# EAGLE design ARM_critter_v02 (EAGLE 6.1)
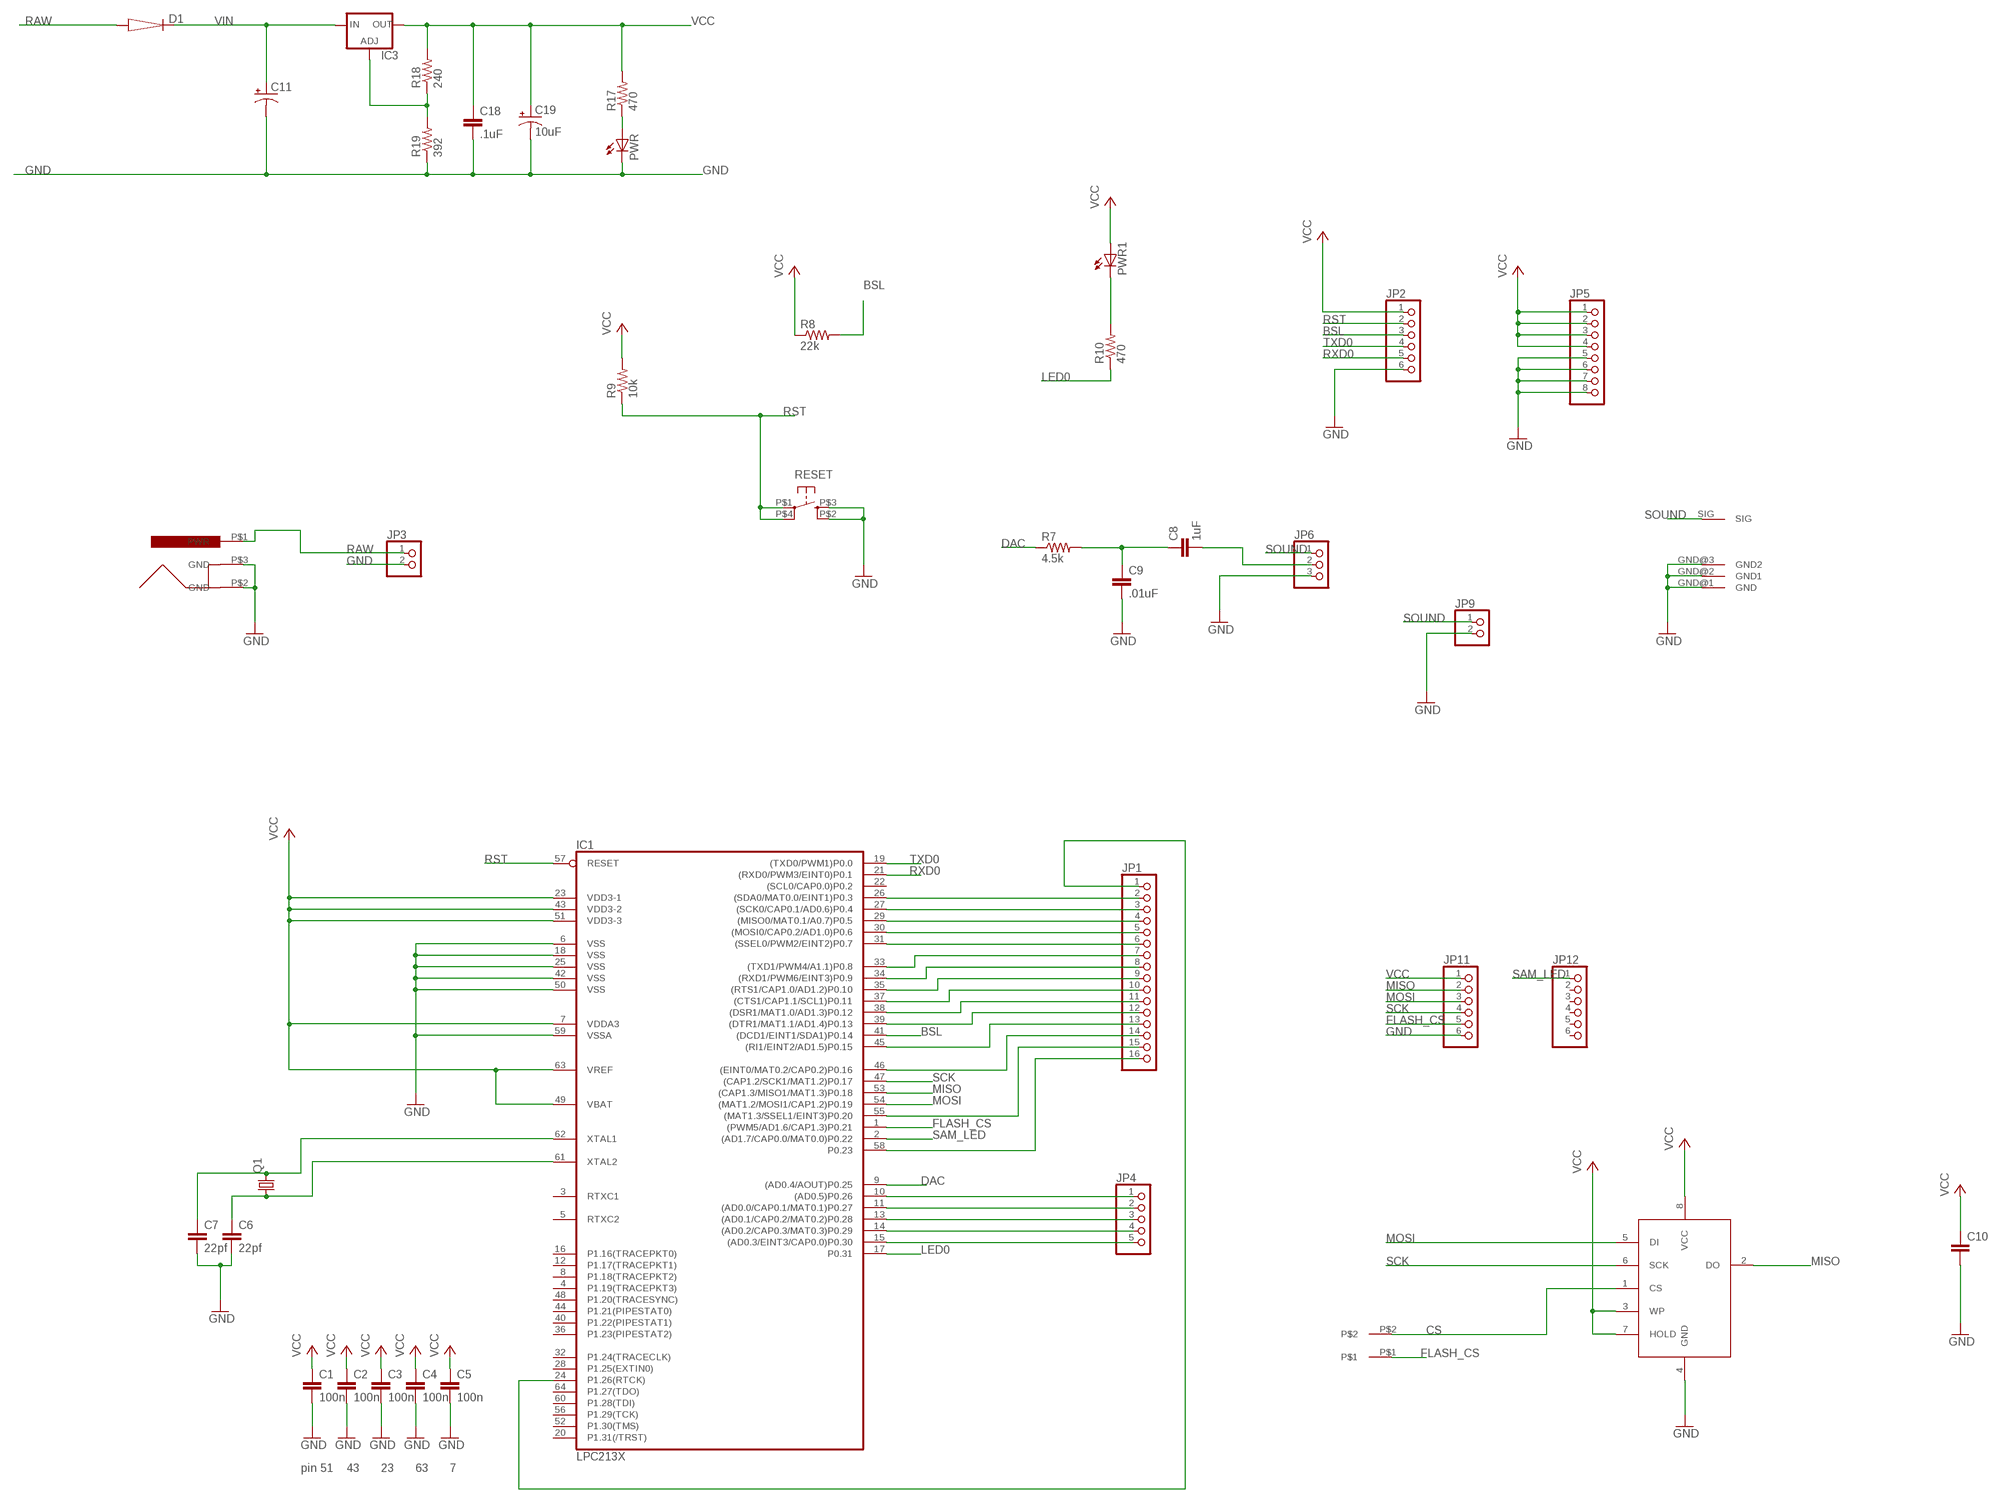
[diagram p0: schematic, sheet 1]

## Parts
C1  100n  CAP0603  [C0603]
C2  100n  CAP0603  [C0603]
C3  100n  CAP0603  [C0603]
C4  100n  CAP0603  [C0603]
C5  100n  CAP0603  [C0603]
C6  22pf  CAP0603  [C0603]
C7  22pf  CAP0603  [C0603]
C8  1uF  CAP0603  [C0603]
C9  .01uF  CAP0603  [C0603]
C10  CAP0603  [C0603]
C11  CPOL-USE3.5-8  [E3,5-8]
C18  .1uF  CAP0603  [C0603]
C19  10uF  CAP_POL1206  [CPOL_1206]
D1  DIODESMB  [SMB]
IC1  LPC213X  [SQFP-S-10X10-64]
IC3  V_REG_FAN1117SOT223  [SOT223]
JP1  PINHD-1X16  [1X16]
JP2  PINHD-1X6  [1X06]
JP3  PINHD-1X2  [1X02]
JP4  PINHD-1X5  [1X05]
JP5  PINHD-1X8  [1X08]
JP6  PINHD-1X3  [1X03]
JP9  PINHD-1X2  [1X02]
JP11  PINHD-1X6  [1X06]
JP12  PINHD-1X6  [1X06]
PWR  LED1206  [CHIPLED_1206]
PWR1  LED1206  [CHIPLED_1206]
Q1  CRYSTALHC49UV  [HC49U-V]
R7  4.5k  RES0603  [R0603]
R8  22k  RES0603  [R0603]
R9  10k  RES0603  [R0603]
R10  470  RES0603  [R0603]
R17  470  RES0603  [R0603]
R18  240  RES0603  [R0603]
R19  392  RES0603  [R0603]
RESET  RESET_SWITCH  [TACTILE_SWITCH_SMD]
U$1  POWER_JACK  POWER_JACKTHRU-HOLE  [POWER_JACK]
U$2  M25PXX  [SO08]
U$3  JUMPER_SOL  [JUMPER_SOL]
U$5  PHONO_PLUG  [PHONO_PCB]

## Nets
BSL: IC1.41((DCD1/EINT1/SDA1)P0.14) JP2.3 R8.2
CS: U$2.1(CS) U$3.P$2
DAC: IC1.9((AD0.4/AOUT)P0.25) R7.1
FLASH_CS: IC1.1((PWM5/AD1.6/CAP1.3)P0.21) JP11.5 U$3.P$1
GND [power]: C1.2 C2.2 C3.2 C4.2 C5.2 C6.2 C7.2 C9.2 C10.2 C11.- C18.2 C19.C(-) IC1.6(VSS) IC1.18(VSS) IC1.25(VSS) IC1.42(VSS) IC1.50(VSS) IC1.59(VSSA) JP2.6 JP3.2 JP5.5 JP5.6 JP5.7 JP5.8 JP6.3 JP9.2 JP11.6 PWR.C R19.1 RESET.P$2(S1) RESET.P$3(S) U$1.P$2(GND) U$1.P$3(GND) U$2.4(GND) U$5.GND@1(GND) U$5.GND@2(GND1) U$5.GND@3(GND2)
LED0: IC1.17(P0.31) R10.1
MISO: IC1.53((CAP1.3/MISO1/MAT1.3)P0.18) JP11.2 U$2.2(DO)
MOSI: IC1.54((MAT1.2/MOSI1/CAP1.2)P0.19) JP11.3 U$2.5(DI)
N$1: C8.1 C9.1 R7.2
N$2: C7.1 IC1.62(XTAL1) Q1.2
N$3: C6.1 IC1.61(XTAL2) Q1.1
N$4: PWR1.C R10.2
N$5: IC1.24(P1.26(RTCK)) JP1.1
N$7: C8.2 JP6.2
N$9: IC1.26((SDA0/MAT0.0/EINT1)P0.3) JP1.2
N$10: IC1.27((SCK0/CAP0.1/AD0.6)P0.4) JP1.3
N$11: IC3.1(ADJ) R18.1 R19.2
N$12: IC1.29((MISO0/MAT0.1/A0.7)P0.5) JP1.4
N$13: IC1.30((MOSI0/CAP0.2/AD1.0)P0.6) JP1.5
N$14: IC1.31((SSEL0/PWM2/EINT2)P0.7) JP1.6
N$15: IC1.33((TXD1/PWM4/A1.1)P0.8) JP1.7
N$16: IC1.34((RXD1/PWM6/EINT3)P0.9) JP1.8
N$17: IC1.35((RTS1/CAP1.0/AD1.2)P0.10) JP1.9
N$18: IC1.37((CTS1/CAP1.1/SCL1)P0.11) JP1.10
N$19: IC1.38((DSR1/MAT1.0/AD1.3)P0.12) JP1.11
N$20: IC1.39((DTR1/MAT1.1/AD1.4)P0.13) JP1.12
N$21: IC1.45((RI1/EINT2/AD1.5)P0.15) JP1.13
N$22: IC1.46((EINT0/MAT0.2/CAP0.2)P0.16) JP1.14
N$23: IC1.55((MAT1.3/SSEL1/EINT3)P0.20) JP1.15
N$24: PWR.A R17.1
N$25: IC1.58(P0.23) JP1.16
N$26: IC1.10((AD0.5)P0.26) JP4.1
N$27: IC1.11((AD0.0/CAP0.1/MAT0.1)P0.27) JP4.2
N$28: IC1.13((AD0.1/CAP0.2/MAT0.2)P0.28) JP4.3
N$29: IC1.14((AD0.2/CAP0.3/MAT0.3)P0.29) JP4.4
N$30: IC1.15((AD0.3/EINT3/CAP0.0)P0.30) JP4.5
RAW: D1.2(C) JP3.1 U$1.P$1(PWR)
RST: IC1.57(RESET) JP2.2 R9.1 RESET.P$1(P) RESET.P$4(P1)
RXD0: IC1.21((RXD0/PWM3/EINT0)P0.1) JP2.5
SAM_LED: IC1.2((AD1.7/CAP0.0/MAT0.0)P0.22) JP12.1
SCK: IC1.47((CAP1.2/SCK1/MAT1.2)P0.17) JP11.4 U$2.6(SCK)
SOUND: JP6.1 JP9.1 U$5.SIG
TXD0: IC1.19((TXD0/PWM1)P0.0) JP2.4
VCC [power]: C1.1 C2.1 C3.1 C4.1 C5.1 C10.1 C18.1 C19.A(+) IC1.7(VDDA3) IC1.23(VDD3-1) IC1.43(VDD3-2) IC1.49(VBAT) IC1.51(VDD3-3) IC1.63(VREF) IC3.2(OUT) JP2.1 JP5.1 JP5.2 JP5.3 JP5.4 JP11.1 PWR1.A R8.1 R9.2 R17.2 R18.2 U$2.3(WP) U$2.7(HOLD) U$2.8(VCC)
VIN [power]: C11.+ D1.1(A) IC3.3(IN)
Unconnected: IC1.3(RTXC1) IC1.4(P1.19(TRACEPKT3)) IC1.5(RTXC2) IC1.8(P1.18(TRACEPKT2)) IC1.12(P1.17(TRACEPKT1)) IC1.16(P1.16(TRACEPKT0)) IC1.20(P1.31(/TRST)) IC1.22((SCL0/CAP0.0)P0.2) IC1.28(P1.25(EXTIN0)) IC1.32(P1.24(TRACECLK)) IC1.36(P1.23(PIPESTAT2)) IC1.40(P1.22(PIPESTAT1)) IC1.44(P1.21(PIPESTAT0)) IC1.48(P1.20(TRACESYNC)) IC1.52(P1.30(TMS)) IC1.56(P1.29(TCK)) IC1.60(P1.28(TDI)) IC1.64(P1.27(TDO)) JP12.2 JP12.3 JP12.4 JP12.5 JP12.6

## Notes on the sheet
- pin 51 | 43 | 23 | 63 | 7

## Library data of the parts
C1-C10 C18 = SparkFun:CAP: CAPACITOR
C11 = rcl:CPOL-US: POLARIZED CAPACITOR, American symbol
C19 = SparkFun:CAP_POL
D1 = SparkFun:DIODE
IC1 = SparkFun:LPC213X
IC3 = SparkFun:V_REG_FAN1117: VOLTAGE REGULATOR
JP1 = pinhead:PINHD-1X16: PIN HEADER
JP2 JP11 JP12 = pinhead:PINHD-1X6: PIN HEADER
JP3 JP9 = pinhead:PINHD-1X2: PIN HEADER
JP4 = pinhead:PINHD-1X5: PIN HEADER
JP5 = pinhead:PINHD-1X8: PIN HEADER
JP6 = pinhead:PINHD-1X3: PIN HEADER
PWR PWR1 = SparkFun:LED
Q1 = SparkFun:CRYSTAL
R7-R10 R17-R19 = SparkFun:RES: RESISTOR
RESET = SparkFun:RESET_SWITCH: OMRON SWITCH
U$1 = SparkFun:POWER_JACK
U$2 = sfe_owen:M25PXX
U$3 = SparkFun:JUMPER_SOL
U$5 = sfe_owen:PHONO_PLUG

## Net classes
0 default: width 0.254 mm
1 power: width 0.254 mm

## Board
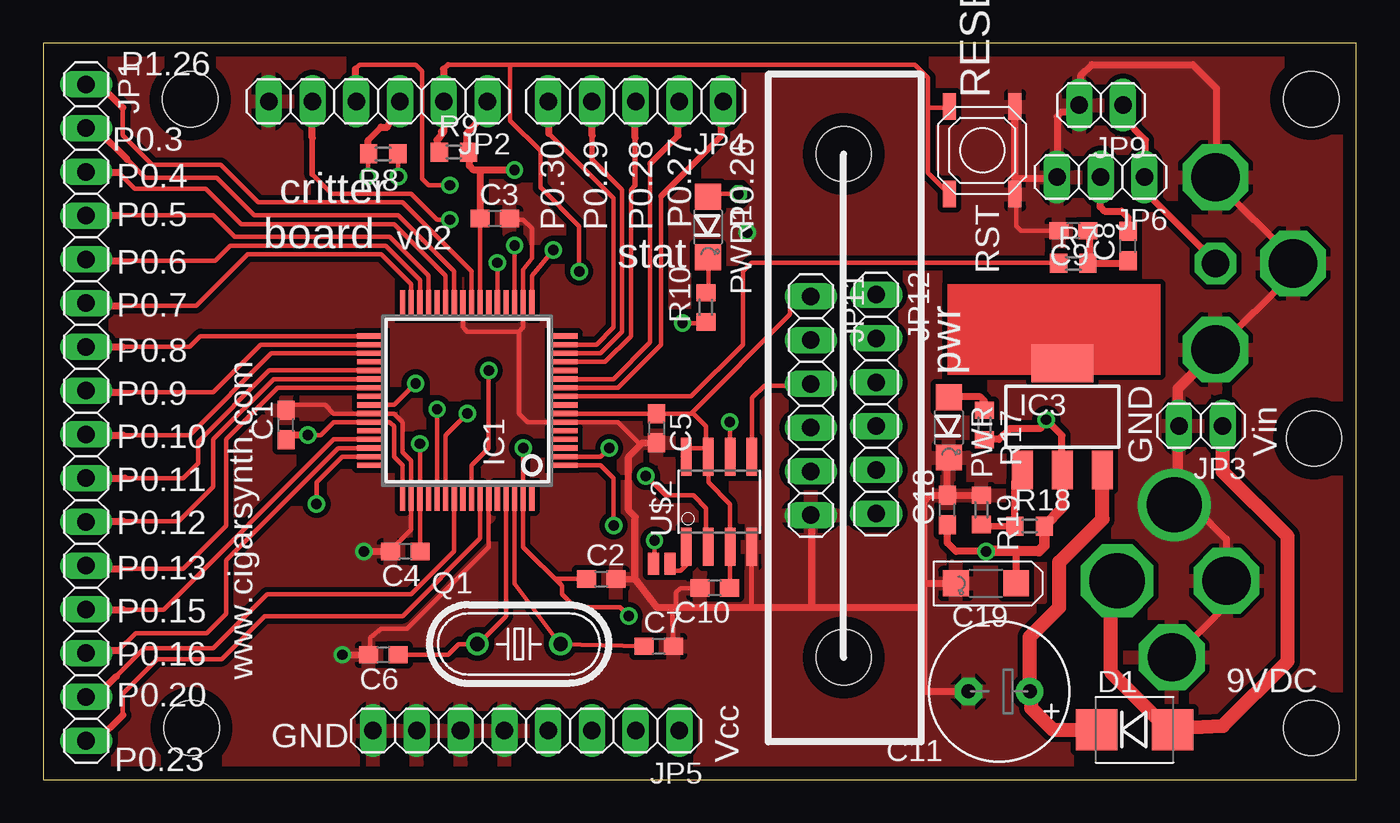
[diagram p1: board, top side]
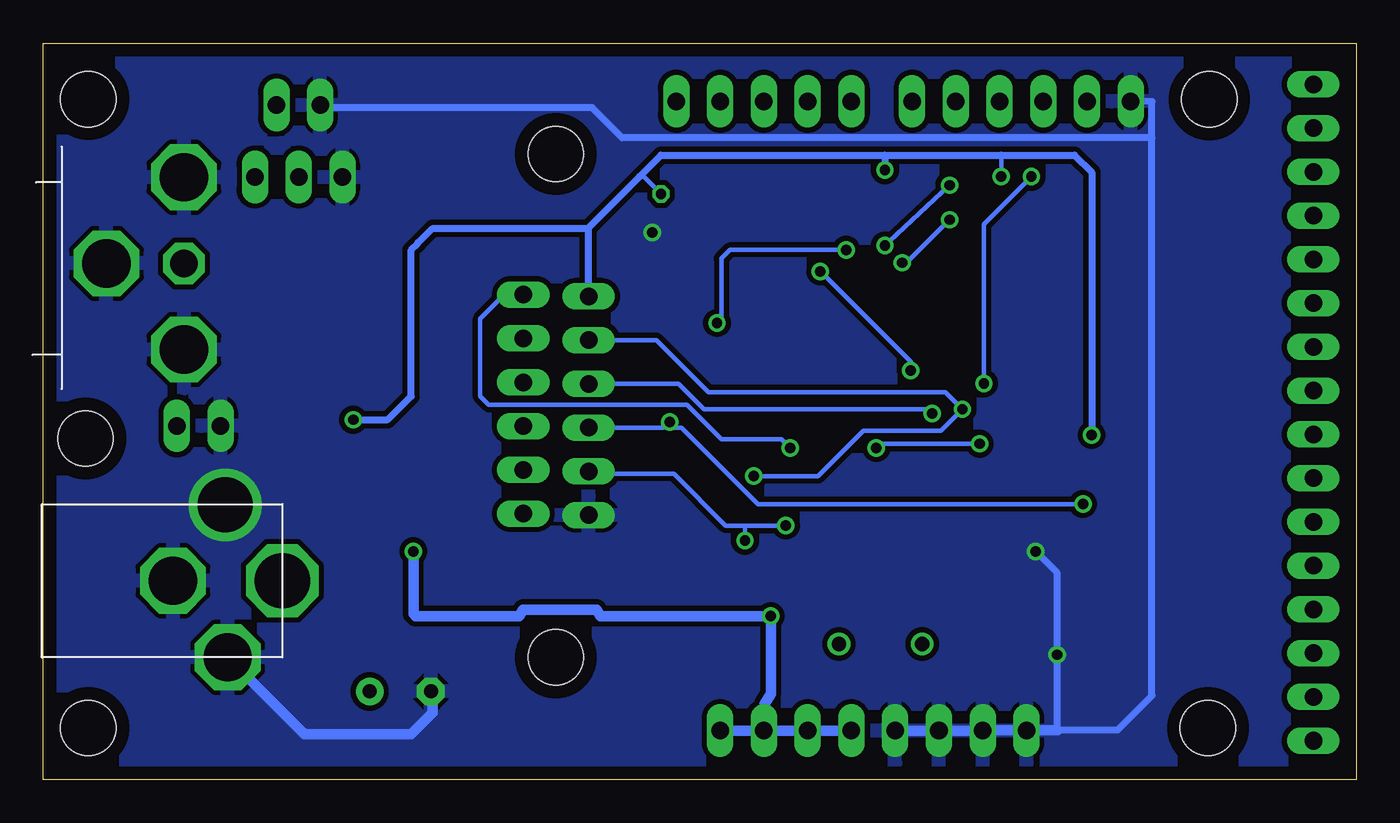
[diagram p2: board, bottom side, seen from below]

Size 76.25 x 42.75 mm. Coordinates in mm from the lower left corner, seen from the top.
Outline: 0,0 76.25,0 76.25,42.75 0,42.75 0,0
Copper layers (1*16): Top 0.035mm / dielectric 1.5mm / Bottom 0.035mm
Design rules: minimum track width 10mil, minimum drill 20mil, track to track 0.2mm, track to pad 0.2mm, pad to pad 0.2mm, via to via 0.2mm, smd to smd 0.2mm, copper to edge 30mil, drill to drill 8mil, minimum pad ring 10mil, minimum via ring 8mil, stop-mask expansion 4mil, vias tented up to drill 0mil, thermal gap 10mil
Holes 3.2 mm at 46.48,7.1 46.48,36.31 73.62,3 73.62,39.5 73.78,19.8 8.54,39.48 8.62,3

### Footprints (pad centres in the part's own frame; a part is rotated, then mirrored left to right if it is on the bottom)
C0603 = smd 1.1 x 1: 1 -0.85,0; 2 0.85,0
E3,5-8 = drill 0.813 pad 1.6: + -1.778,0 | drill 0.813 pad 1.6 octagon: - 1.778,0
CPOL_1206 = smd 1.5 x 1.5: A 0,-1.75; C 0,1.75
SMB = smd 2.4 x 2.4: 1 -2.2,0; 2 2.2,0
SQFP-S-10X10-64 = smd 0.3 x 1.6: 1 -3.75,-5.6; 2 -3.25,-5.6; 3 -2.75,-5.6; 4 -2.25,-5.6; 5 -1.75,-5.6; 6 -1.25,-5.6; 7 -0.75,-5.6; 8 -0.25,-5.6; 9 0.25,-5.6; 10 0.75,-5.6; 11 1.25,-5.6; 12 1.75,-5.6; 13 2.25,-5.6; 14 2.75,-5.6; 15 3.25,-5.6; 16 3.75,-5.6; 33 3.75,5.6; 34 3.25,5.6; 35 2.75,5.6; 36 2.25,5.6; 37 1.75,5.6; 38 1.25,5.6; 39 0.75,5.6; 40 0.25,5.6; 41 -0.25,5.6; 42 -0.75,5.6; 43 -1.25,5.6; 44 -1.75,5.6; 45 -2.25,5.6; 46 -2.75,5.6; 47 -3.25,5.6; 48 -3.75,5.6 | smd 1.6 x 0.3: 17 5.6,-3.75; 18 5.6,-3.25; 19 5.6,-2.75; 20 5.6,-2.25; 21 5.6,-1.75; 22 5.6,-1.25; 23 5.6,-0.75; 24 5.6,-0.25; 25 5.6,0.25; 26 5.6,0.75; 27 5.6,1.25; 28 5.6,1.75; 29 5.6,2.25; 30 5.6,2.75; 31 5.6,3.25; 32 5.6,3.75; 49 -5.6,3.75; 50 -5.6,3.25; 51 -5.6,2.75; 52 -5.6,2.25; 53 -5.6,1.75; 54 -5.6,1.25; 55 -5.6,0.75; 56 -5.6,0.25; 57 -5.6,-0.25; 58 -5.6,-0.75; 59 -5.6,-1.25; 60 -5.6,-1.75; 61 -5.6,-2.25; 62 -5.6,-2.75; 63 -5.6,-3.25; 64 -5.6,-3.75
SOT223 = smd 1.219 x 2.235: 1 -2.311,-3.099; 2 0,-3.099; 3 2.311,-3.099 | smd 3.6 x 2.2: 4 0,3.099
1X16 = drill 1.016 long: 1 -19.05,0; 2 -16.51,0; 3 -13.97,0; 4 -11.43,0; 5 -8.89,0; 6 -6.35,0; 7 -3.81,0; 8 -1.27,0; 9 1.27,0; 10 3.81,0; 11 6.35,0; 12 8.89,0; 13 11.43,0; 14 13.97,0; 15 16.51,0; 16 19.05,0
1X06 = drill 1.016 long: 1 -6.35,0; 2 -3.81,0; 3 -1.27,0; 4 1.27,0; 5 3.81,0; 6 6.35,0
1X02 = drill 1.016 long: 1 -1.27,0; 2 1.27,0
1X05 = drill 1.016 long: 1 -5.08,0; 2 -2.54,0; 3 0,0; 4 2.54,0; 5 5.08,0
1X08 = drill 1.016 long: 1 -8.89,0; 2 -6.35,0; 3 -3.81,0; 4 -1.27,0; 5 1.27,0; 6 3.81,0; 7 6.35,0; 8 8.89,0
1X03 = drill 1.016 long: 1 -2.54,0; 2 0,0; 3 2.54,0
CHIPLED_1206 = smd 1.5 x 1.5: A 0,-1.75; C 0,1.75
HC49U-V = drill 0.813: 1 -2.413,0; 2 2.413,0
R0603 = smd 1 x 1.1: 1 -0.85,0; 2 0.85,0
TACTILE_SWITCH_SMD = smd 1.524 x 0.762: P$1 -2.54,1.905; P$2 -2.54,-1.905; P$3 2.54,-1.905; P$4 2.54,1.905
POWER_JACK = drill 3.2 octagon: P$1 0,4.445 | drill 2.8 octagon: P$2 3.175,8.89; P$3 6.35,4.445
SO08 = smd 0.61 x 2.21: 1 -1.905,-2.616; 2 -0.635,-2.616; 3 0.635,-2.616; 4 1.905,-2.616; 5 1.905,2.616; 6 0.635,2.616; 7 -0.635,2.616; 8 -1.905,2.616
JUMPER_SOL = smd 0.635 x 1.27: P$1 0,0; P$2 0.953,0
PHONO_PCB = drill 2.8 octagon: GND@1 0,5; GND@2 0,-5; GND@3 4.5,0 | drill 1.6 octagon: SIG 0,0

### Placement (x,y rotation side)
C1  14.11,20.58 90 top
C2  32.41,11.65 0 top
C3  26.23,32.57 0 top
C4  21.03,13.25 180 top
C5  35.61,20.39 270 top
C6  19.75,7.25 180 top
C7  35.75,7.75 0 top
C8  62.99,30.97 90 top
C9  59.81,31.86 180 top
C10  39,11.12 180 top
C11  55.51,5.12 180 top
C18  52.5,15.65 90 top
C19  54.74,11.39 90 top
D1  63.37,2.9 0 top
IC1  24.62,22 90 top
IC3  59.18,21.07 0 top
JP1  2.5,21.31 270 top
JP2  19.45,39.37 180 top
JP3  67.22,20.54 180 top
JP4  34.41,39.37 180 top
JP5  28.05,2.85 180 top
JP6  61.4,34.98 180 top
JP9  61.42,39.15 180 top
JP11  44.58,21.7 270 top
JP12  48.37,21.8 270 top
PWR  52.59,20.45 180 top
PWR1  38.61,32.08 180 top
Q1  27.62,7.88 0 top
R7  59.81,29.96 0 top
R8  19.75,36.32 180 top
R9  23.85,36.42 0 top
R10  38.48,27.41 90 top
R17  54.65,20.59 270 top
R18  57.27,14.72 0 top
R19  54.48,15.66 270 top
RESET  54.52,36.52 90 top
U$1  62.35,15.99 180 bottom
U$2  39.25,16.12 0 top
U$3  35.44,12.53 0 top
U$5  68.07,29.96 180 bottom

### Tracks (layer width: path | path; a pad name or v marks a point on that pad's centre or on a via)
BSL  (via drill 0.6)
  Top 0.254: v18.88,35 18.88,36.17 R8.2 18.88,36.47 | 18.88,21.75 IC1.41 20.38,21.75 v21.62,23
  Top 0.305: 18.88,37.12 19.62,37.88
  Top 0.406: JP2.3 20,37.88 19.62,37.88 | 18.88,36.47 18.88,37.12
  Bottom 0.254: v18.88,35 21.62,32.25 v21.62,23
CS
  Top 0.254: U$2.1 37.34,12.47 37,12.12 36.38,12.12 36.39,12.14 U$3.P$2
DAC
  Top 0.254: IC1.9 37.62,22.25 40.62,25.25 40.62,29.5 41.12,30 58.62,30 58.88,29.75 58.97,29.84 R7.1
FLASH_CS  (via drill 0.6)
  Top 0.254: IC1.1 32.38,18.25 33.12,17.5 v33.12,14.75 | U$3.P$1 35.46,12.12 35.5,12.12 v35.5,13.88
  Bottom 0.254: JP11.5 44.47,18 44.22,17.75 39.62,17.75 36.62,14.75 35.5,14.75 | 35.5,14.75 v33.12,14.75 | v35.5,13.88 35.5,14.75
GND  (via drill 0.6, 3.2)
  Top 0.254: C1.2 14.12,21.44 14.12,21.75 16.38,21.75 16.88,21.25 IC1.42 20.38,21.25 20.88,20.75 20.88,19 21.38,18.5 21.38,16.25 | 21.38,16.25 21.38,14.5 20.12,13.25 C4.2 | C5.2 35.61,19.51 35.62,19.5 34.62,19.5 33.38,20.75 IC1.6 28.12,20.75 27.62,21.25 27.62,26 | IC1.25 24.38,26.25 24.62,26 27.62,26 | 27.62,26 27.88,26.25 IC1.18 27.88,29.6 28.38,30.25 28.38,32 27.88,32.5 27.12,32.5 27.12,32.53 C3.2 | 21.38,16.25 IC1.50 | IC1.59 25.88,13.5 21.12,8.75 19.62,8.75 19,8.25 19,7.25 | U$2.4 41.12,12.5 41.12,10 | C10.2 37,11.12 36.75,10.88 36.75,10 | 36.5,10 C7.2 | 60.12,38.88 60.02,38.9 | C9.2 56.76,31.86 56.5,32.12 56.5,33.88 56.39,33.98
  Top 0.406: 68.07,24.88 67.91,24.72 | 68.07,24.88 U$5.GND@1 | 68.07,24.88 72.57,29.38 U$5.GND@3 72.57,30.22 68.07,34.72 U$5.GND@2 68.12,34.91 | 44.62,10 41.12,10 36.75,10 36.5,10 35.62,10 34.38,11.62 | 44.62,10 51.12,10 51.13,11.38 | JP11.6 44.62,15.12 44.62,10 | C2.2 34.38,11.62 | RESET.P$3 56.49,39 56.5,39 | 56.5,34.38 56.38,33.88 56.38,33.93 RESET.P$2 56.39,33.98 56.38,34 56.43,34.05 RESET.P$3 | v18.62,13.25 20.12,13.25 | v17.38,7.25 19,7.25 C6.2 | 51.13,11.38 51.13,11.51 | 51.13,11.51 51.13,5.83 | 51.13,5.83 51.09,5.21 51.12,5.12 | 51.13,11.38 51.13,11.49 51.13,11.51 | 51.13,11.51 51.13,16.14 51.5,16.5 C18.2 | C5.2 34.79,19.54 34,18.75 34,15.62 34.38,15.25 34.38,11.62 | v65.68,15.95 65.68,15.82 65.88,15.62 67,15.62 68.67,13.96 68.7,13.96 U$1.P$3 68.7,10.12 65.69,7.1 U$1.P$2 65.5,7.07 | C9.2 58.88,31.86 58.88,31.88 59.02,32.02 | R19.1 C18.2 | PWR.C 52.5,18.7 C18.2 | C18.2 | 51.13,11.38 51.12,11.38 51.14,11.39 C19.C | 51.12,5.12 53.75,5.12 | 51.13,5.83 51.12,5.82 51.12,5.25 | 51.12,5.25 51.12,6 51.12,5.12 | 51.12,5.25 51.12,5.12 | 60.02,38.9 60.25,38.9 60.25,40.88 60.88,41.5 66.75,41.5 68.12,40.12 68.12,34.91 | 68.12,34.91 68.12,34.88 | JP9.2 60.15,38.85 60.12,38.88 60,38.75 59.12,38.75 58.88,38.5 58.88,34.99 JP6.3 58.86,34.88 | 58.86,34.88 58.88,34.88 | RESET.P$3 56.43,34.88 58.86,34.88
  Top 0.61: 67.91,24.72 65.88,22.68 65.88,20.5 65.91,20.5 JP3.2 65.88,20.09 65.88,15.77 | 65.88,15.77 65.62,15.88 | 65.88,15.77 v65.68,15.95
  Bottom 0.406: 11.88,37.25 42.62,37.25 44.38,39 59.88,39 60.12,38.75 JP9.2 | 11.88,37.25 11.88,4.88 13.88,2.88 17.38,2.88 v17.38,7.25 17.38,12 v18.62,13.25 | JP2.6 11.88,39.34 11.88,37.25
  Bottom 0.61: 21.73,2.85 21.62,2.88 17.38,2.88 | 21.73,2.85 JP5.7 | 21.73,2.85 24.15,2.85 24.38,2.75 24.35,2.85 JP5.6 26.73,2.85 | 26.73,2.85 26.65,2.85 26.88,2.88 26.73,2.85 | 26.73,2.85 JP5.5 | 65.5,7.07 61.05,2.62 54.88,2.62 53.62,3.88 53.62,5.12 53.61,5.25 C11.-
  other vias: 40.88,31.75
  pour Top (isolate 0.305): -0.75,43.25 77.62,43.25 77.62,-0.62 -0.75,-0.62
  pour Bottom (isolate 0.305): -1.88,43.5 78.38,43.5 78.38,-1.38 -2.12,-1.38
LED0  (via drill 0.6)
  Top 0.254: R10.1 38.42,26.5 v37.12,26.5 | v29.62,30.75 28.38,29.25 IC1.17
  Bottom 0.254: v37.12,26.5 36.88,26.75 36.88,30.25 36.38,30.75 v29.62,30.75
MISO  (via drill 0.6)
  Top 0.254: IC1.53 v22.88,21.5 | U$2.2 38.5,13.51 38.5,15.75 37.75,16.5 36.12,16.5 v35,17.62
  Bottom 0.254: JP11.2 40.64,25.52 37.62,22.5 23.88,22.5 v22.88,21.5 24.12,20.25 28.62,20.25 31.25,17.62 v35,17.62
MOSI  (via drill 0.6)
  Top 0.254: v24.62,21.25 23.38,20 IC1.54 | U$2.5 41.16,22.16 41.88,22.88 44.5,22.88 44.6,22.98 | 44.6,22.98 44.62,23 | JP11.3 44.6,22.98
  Bottom 0.254: JP11.3 39.35,22.98 37.88,21.5 24.88,21.5 v24.62,21.25
N$1
  Top 0.406: R7.2 60.61,29.96 | C8.1 62.78,29.96 R7.2 | C9.1 60.77,31.86 60.77,30.06 R7.2
N$2
  Top 0.254: 30,7.88 C7.1 | Q1.2 30,7.88 | IC1.62 27.38,11.38 30,7.88
N$3
  Top 0.254: C6.1 20.88,7.25 | IC1.61 26.88,9.5 25.25,7.88 Q1.1 24.12,7.88 23.5,7.25 C6.1 | C6.1 20.5,7.25
N$4
  Top 0.254: R10.2 38.49,28.25 38.62,28.25 38.62,30.32 PWR1.C
N$5
  Top 0.254: IC1.24 24.88,29.5 20.88,33.5 12.5,33.5 10.32,35.68 6.34,35.68 4.62,37.4 4.62,39 | JP1.1 2.52,40.38
  Top 0.406: 4.62,39 3.25,40.38 2.52,40.38
N$7
  Top 0.406: C8.2 62.99,32.64 62.62,33 61.62,33 61.38,33.25 61.38,34.88 61.4,34.9 JP6.2
N$9
  Top 0.254: IC1.26 23.88,29.5 20.62,32.75 12.25,32.75 10.07,34.93 5.94,34.93 4.88,36 | 2.43,37.75 2.38,37.75 | JP1.2 2.43,37.75 | 2.43,37.75 3.12,37.75
  Top 0.406: 3.12,37.75 4.88,36
N$10
  Top 0.254: IC1.27 23.38,29.25 20.38,32.25 11.5,32.25 9.44,34.31 5.32,34.31 4.38,35.25 | JP1.3 2.5,35.25
  Top 0.406: 2.5,35.25 4.38,35.25
N$11
  Top 0.406: IC3.1 56.87,17.81 56.42,17.36 R18.1 54.5,14.75 R19.2
N$12
  Top 0.254: IC1.29 22.38,29.25 20.12,31.5 11.12,31.5 9.88,32.75 4.38,32.75 | JP1.4
  Top 0.406: JP1.4 4.38,32.75
N$13
  Top 0.254: IC1.30 21.88,29 19.88,31 10.88,31 10,30.12 4.5,30.12 | JP1.5 2.58,30.12
  Top 0.406: 2.58,30.12 4.5,30.12
N$14
  Top 0.254: IC1.31 21.38,28.75 19.62,30.5 11.88,30.5 8.88,27.5 4.5,27.5 | 2.5,27.5 JP1.6
  Top 0.406: 2.5,27.5 4.5,27.5
N$15
  Top 0.254: IC1.33 9.12,25.75 8.5,25.12 4.62,25.12 | JP1.7
  Top 0.406: JP1.7 4.62,25.12
N$16
  Top 0.254: IC1.34 12.62,25.25 9.88,22.5 4.5,22.5 | 2.5,22.5 JP1.8
  Top 0.406: 2.5,22.5 4.5,22.5
N$17
  Top 0.254: IC1.35 13.25,24.75 8.5,20 4.62,20 | 2.5,20 JP1.9
  Top 0.406: 2.5,20 4.62,20
N$18
  Top 0.254: IC1.37 13.12,23.75 9,19.62 9,18.38 8.12,17.5 4.75,17.5 | JP1.10 2.38,17.5
  Top 0.406: JP1.10 4.75,17.5
N$19
  Top 0.254: IC1.38 13.38,23.25 9.88,19.75 9.88,17 7.88,15 4.62,15 | 2.5,15 JP1.11
  Top 0.406: 2.5,15 4.62,15
N$20
  Top 0.254: IC1.39 13.62,22.75 10.62,19.75 10.62,14.75 8.12,12.25 4.5,12.25 | 2.5,12.25 JP1.12
  Top 0.406: 2.5,12.25 4.5,12.25
N$21
  Top 0.254: IC1.45 16.88,19.75 7,9.88 4.62,9.88 | JP1.13
  Top 0.406: JP1.13 4.62,9.88
N$22
  Top 0.254: IC1.46 17.12,19.25 10.62,12.75 10.62,9.62 9.5,8.5 5.38,8.5 4.38,7.5 | 2.5,7.5 JP1.14
  Top 0.406: 2.5,7.5 4.38,7.5
N$23
  Top 0.254: IC1.55 23.88,13.25 21.38,10.75 13,10.75 9.88,7.62 5.88,7.62 4.25,6 | JP1.15 2.5,4.75 3,4.75
  Top 0.406: 3,4.75 4.25,6
N$24
  Top 0.406: PWR.A 53,22.25 54.38,22.25 54.62,22 54.62,21.5 R17.1
N$25
  Top 0.254: IC1.58 25.38,14 20.88,9.5 12.88,9.5 10.38,7 6.62,7 4.62,5 4.62,3.75 | JP1.16 3.12,2.25
  Top 0.406: 3.12,2.25 4.62,3.75
N$26
  Top 0.254: IC1.10 33.38,22.75 35.88,25.25 35.88,33.88 | 39.38,39.25 39.51,39.37 JP4.1
  Top 0.305: 35.88,33.88 39.38,37.38
  Top 0.406: 39.38,37.38 39.38,39.25
N$27
  Top 0.254: IC1.11 33.12,23.25 35.25,25.38 35.25,35.75 | 36.88,39.5 36.88,39.44 JP4.2
  Top 0.305: 35.25,35.75 36.88,37.38
  Top 0.406: 36.88,37.38 36.88,39.44
N$28
  Top 0.254: IC1.13 32.62,24.25 34.12,25.75 34.12,34.25 34.38,34.5 | 34.38,39.75 34.38,39.4 JP4.3
  Top 0.305: 34.38,34.5 34.38,37.25
  Top 0.406: 34.38,37.25 34.38,39.4
N$29
  Top 0.254: IC1.14 32.38,24.75 33.62,26 33.62,34.25 31.88,36 | 31.88,39.5 JP4.4
  Top 0.305: 31.88,36 31.88,37.38
  Top 0.406: 31.88,37.38 JP4.4
N$30
  Top 0.254: IC1.15 32.12,25.25 33.12,26.25 33.12,33.75 29.38,37.5 | 29.38,39.32 JP4.5
  Top 0.406: 29.38,37.5 29.38,39.32
RAW
  Top 0.813: U$1.P$1 62,11.31 62,6.25 65.25,3 65.5,3 | JP3.1 68.49,17.88 72.25,14.12 72.25,6.88 68.5,3.12 65.5,3 | D1.2 65.75,2.9 65.75,3 65.5,3
RST  (via drill 0.6)
  Top 0.254: 51.38,35.23 RESET.P$1 | 51.38,35.23 51.38,39 52.55,39 RESET.P$4 | 51.38,35.23 51.38,40.75 50.62,41.5 27.12,41.5 | 27.12,41.5 23.5,41.5 | JP2.2 | 28.88,34.38 28.88,36.5 27.12,38.25 27.12,41.5 | 28.88,34.38 28.88,34.34 | v25.88,23.75 25.88,19.25 24.88,18.25 IC1.57 24.88,16.25 | v31.12,29.5 31.12,32.12 28.88,34.38
  Top 0.305: 23.5,41.5 23.25,41.25
  Top 0.406: JP2.2 23.26,37.62 23.12,37.62 23.25,37.62 22.88,37.12 22.88,36.5 22.95,36.42 R9.1 | 23.25,41.25 JP2.2
  Bottom 0.254: v31.12,29.5 25.88,24.25 v25.88,23.75
RXD0  (via drill 0.6)
  Top 0.254: 15.62,39.1 JP2.5 | 15.62,35.12 16.75,34 21.38,34 22.88,32.5 v23.62,32.5 | 26.38,27.5 IC1.21 v26.38,30
  Top 0.305: 15.62,35.12 15.62,37.25
  Top 0.406: 15.62,37.25 15.62,39.1
  Bottom 0.254: v23.62,32.5 26.12,30 v26.38,30
SAM_LED  (via drill 0.6)
  Top 0.254: IC1.2 32.38,18.75 v32.88,19.25
  Bottom 0.254: v32.88,19.25 33.38,19.75 36.88,19.75 38.88,21.75 50.38,21.75 50.88,22.25 50.88,26.75 49.38,28.25 48.38,28.25 JP12.1
SCK  (via drill 0.6)
  Top 0.254: IC1.47 17.38,18.75 15.88,17.25 v15.88,16 | U$2.6 39.88,20.49 v39.88,20.75
  Bottom 0.254: JP11.4 40.25,20.43 v39.88,20.75 39.56,20.43 39.19,20.43 34.75,16 v15.88,16
SOUND
  Top 0.406: JP9.1 62.69,38.44 64,37.12 64,34.88 63.94,34.94 JP6.1 63.94,34.19 68.12,30 68.08,29.96 U$5.SIG
TXD0  (via drill 0.6)
  Top 0.254: 18.12,39.42 JP2.4 | 18.12,41.25 18.38,41.5 21.62,41.5 22,41.12 22,34.88 22.38,34.5 v23.62,34.5 | 27.38,27.5 IC1.19 v27.38,31
  Top 0.406: 18.12,41.25 18.12,39.42
  Bottom 0.254: v23.62,34.5 27.12,31.25 v27.38,31
VCC  (via drill 0.6)
  Top 0.254: C3.1 IC1.23 | C4.1 IC1.51 v21.88,19.5 | C1.1 14.12,20 16.12,20 16.88,20.75 IC1.43 20.12,20.75 20.38,20.5 20.38,18.75 20.88,18.25 IC1.49 | 27.88,16.25 27.88,13.5 30.12,11.25 | R8.1 20.62,36.41 v20.62,35 | PWR1.A 38.78,34 v40.38,34 | C5.1 IC1.7 | 37.62,21.25 43.38,27 43.38,27.5 43.88,28 44.62,28 JP11.1 | C5.1 | 37.62,21.25 C5.1 | 27.88,16.25 IC1.63 | 27.88,16.25 v27.88,19.25 | JP2.1 25.69,39.38 25.56,38.5 | 37.62,21.25 37.75,21.25 38.5,20.5 38.5,19.25 | 38.75,19.38 38.37,19.24 38.62,19.11 | 38.5,19.25 38.62,19 38.62,18.99 U$2.7 | 38.5,19.25 37.5,19.25 37.34,19.09 U$2.8 37.13,18.74 37.12,18.75 | U$2.7 38.62,19.11 | 38.62,19.11 38.75,19.5 | U$2.7 38.62,17.25 39.88,16 U$2.3 | U$2.3 | 30.12,11.25 30.12,10.75 30.88,10 33.5,10 v34,9.5 | C2.1 29.77,11.65 30.12,11.25 | C10.1 39.85,11.22 39.88,11.25 U$2.3
  Top 0.406: 58.12,14.62 R18.2 | 25.68,39.38 25.56,38.5 24.62,37.55 24.62,36.5 R9.2 24.7,36.45 24.75,36.5 24.75,35.62 25,35.38 25.38,35.38 | C1.1 14.38,20 v15.38,20 | IC3.2 59.16,17.97 59.16,19.98 v58.24,20.89 58.25,20.88 57.88,20.38 56.12,20.38 55.5,19.75 55,19.75 R17.2 | v27.38,35.38 25.38,35.38 | C3.1 25.38,35.37 25.38,35.38 | C18.1 52.5,13.75 53,13.25 v54.75,13.25 54.9,13.27 | 56.5,13.27 56.5,13.25 56.49,13.24 C19.A
  Top 0.61: 58.12,14.62 58.12,13.57 57.82,13.26 56.53,13.27 56.5,13.27 54.9,13.27 | R18.2 59.18,15.78 IC3.2
  Bottom 0.254: 20.62,36.25 v20.62,35 | v40.38,34 41.38,35 41.62,35 | v21.88,19.5 27.62,19.5 v27.88,19.25
  Bottom 0.305: JP2.1 25.8,39.08
  Bottom 0.406: 44.62,32 53.62,32 54.49,31.16 54.49,31.14 54.88,30.75 54.88,22.25 56.23,20.89 v58.24,20.89 | JP11.1 44.62,28.11 44.62,32 | 44.62,32 41.62,35 40.38,36.25 27.38,36.25 | 27.38,36.25 20.62,36.25 16.38,36.25 15.38,35.25 v15.38,20 | 27.38,36.25 v27.38,35.38 | 34.4,2.98 34.38,2.75 JP5.2 | JP5.3 31.75,2.88 | JP5.4 29.27,2.85 29.12,2.75 | 36.94,2.81 36.88,2.75 | 36.94,2.81 JP5.1 | 37.02,2.85 36.94,2.81 | 54.62,9.5 54.75,9.62
  Bottom 0.61: 54.62,9.5 48.62,9.5 48.38,9.88 44.12,9.88 43.88,9.5 v34,9.5 34,5 34.38,4.38 34.38,2.75 | 29.27,2.85 JP5.3 JP5.2 37.02,2.85 | 54.75,9.62 v54.75,13.25
VIN
  Top 0.406: IC3.3 61.56,17.97 | 61.49,18.28 61.52,18.3 61.49,18.33
  Top 0.61: IC3.3 61.49,18.28
  Top 0.813: 61.4,17.97 61.38,18 | 61.4,17.97 IC3.3 | 61.4,17.97 61.5,17.88 61.5,15.12 59,12.62 59,10 57.28,8.28 C11.+ 57.38,5.03 57.38,4.15 58.62,2.9 61,2.9 | 61,2.9 D1.1 | 61,2.9 61,2.88
(copper drawn outside any net)
  shapes: Top area x1

### Text on the board
tPlace: P1.26 | P0.3 | P0.4 | critter | board | P0.5 | P0.30 | P0.29 | P0.28 | stat | P0.27 | P0.26 | v02 | P0.6 | RST | P0.7 | P0.8 | pwr | P0.9 | P0.10 | GND | Vin | P0.11 | P0.12 | P0.13 | P0.15 | P0.16 | 9VDC | www.cigarsynth.com | P0.20 | GND | P0.23 | Vcc